# Altium schematic sheet Current_Sensor.SchDoc
size A
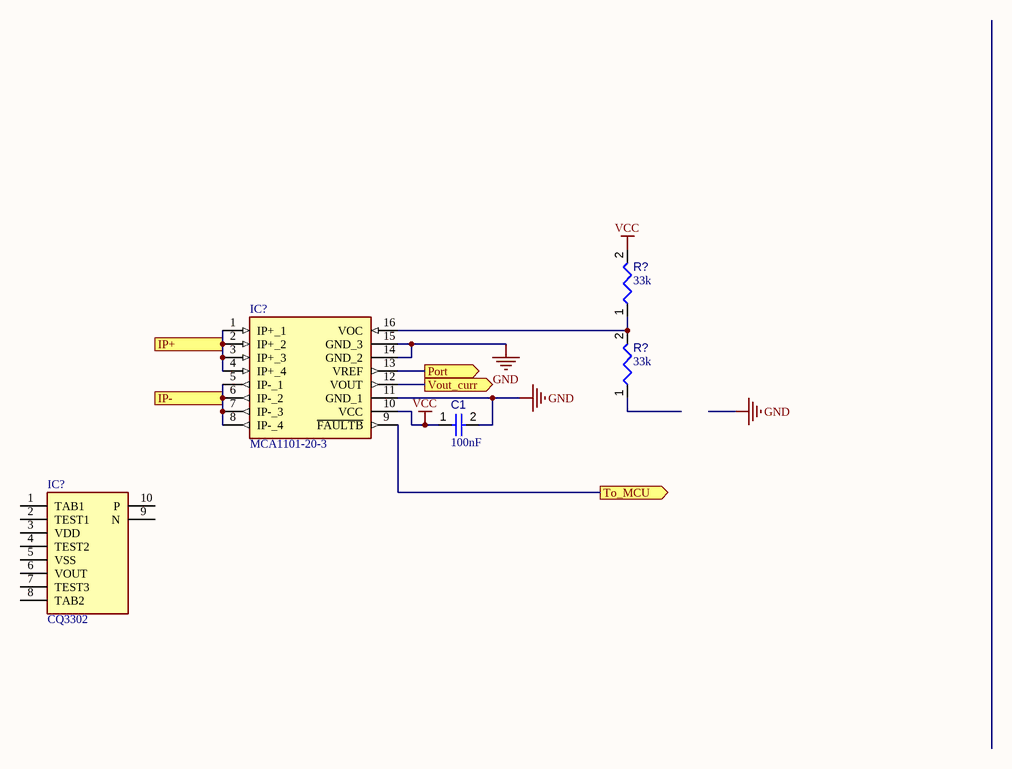
[diagram p0: Current_Sensor.SchDoc]

## Parts
(Parts that share a designator on the sheet are numbered #1, #2 ... from top to bottom, then left to right.)
C1  value 100nF  [CAPC0402(1005)60_L]  (hidden comment: Capacitor 100nF +/-20% 50V 0402)
IC?#1  MCA1101-20-3  [SOIC127P1031X264-16N]
IC?#2  CQ3302  [CQ3303]
R?#1  value 33k  [RESC1005X40X25ML10T10]  (hidden comment: Resistor 33k +/-5% 0402 63 mW)
R?#2  value 33k  [RESC1005X40X25ML10T10]  (hidden comment: Resistor 33k +/-5% 0402 63 mW)

## Ports
IP+ (in), IP- (out), Port (out), To_MCU (out), Vout_curr (out)

## Nets
GND: C1.2 IC?#1.11(GND_1) IC?#1.14(GND_2) IC?#1.15(GND_3)
VCC: C1.1 IC?#1.10(VCC) R?#1.2
IP+: IC?#1.1(IP+_1) IC?#1.2(IP+_2) IC?#1.3(IP+_3) IC?#1.4(IP+_4) ; port IP+
IP-: IC?#1.5(IP-_1) IC?#1.6(IP-_2) IC?#1.7(IP-_3) IC?#1.8(IP-_4) ; port IP-
Port: IC?#1.13(VREF) ; port Port
To_MCU: IC?#1.9(~{FAULTB}) ; port To_MCU
Vout_curr: IC?#1.12(VOUT) ; port Vout_curr
NetIC?#1_16: IC?#1.16(VOC) R?#1.1 R?#2.2

Not connected (* = marked no-connect by the designer): IC?#2 1(TAB1) 2(TEST1) 3(VDD) 4(TEST2) 5(VSS) 6(VOUT) 7(TEST3) 8(TAB2) 9(N) 10(P); R?#2 1

## Library data of the parts
C1 = CMP-001-00067-3: Chip Capacitor, 100nF +/-20%, 50V, 0402, Thickness 0.6 mm; Tolerance: 10%; Min Operating Temperature: -55°C; Pins: 2; Case/Package: 0402; Max Operating Temperature: 85°C; Voltage Rating: 50V; Mounting Technology: SMT
IC?#1 = MCA1101-20-3: Integrated Circuit; Manufacturer_Name: ACEINNA; Datasheet Link: https://componentsearchengine.com/Datasheets/34/MCA1101-20-3.pdf; Height: 2.64mm; Manufacturer_Part_Number: MCA1101-20-3; Mouser Part Number: 438-MCA1101-20-3; Mouser Price/Stock: https://www.mouser.co.uk/ProductDetail/ACEINNA/MCA1101-20-3?qs=PzGy0jfpSMs8efb76nV%2FyQ%3D%3D
IC?#2 = CQ3302: Integrated Circuit; Manufacturer_Name: AKM; Datasheet Link: http://www.akm.com/akm/en/file/datasheet/CQ-3302.pdf; Height: 1.4mm; Manufacturer_Part_Number: CQ3302
R?#1 R?#2 = CMP-009-00028-5: Chip Resistor, 33 KOhm, +/- 5%, 0.063 W, -55 to 155 degC, 0402 (1005 Metric); Power: 63mW; Tolerance: 5%; Case/Package: 0402; Mounting Technology: SM; Min Operating Temperature: -55°C; Max Operating Temperature: 155°C; Pins: 2; RoHS Compliant: True